# Altium schematic sheet H-00488 - Power.SchDoc: Power Supplies
size 403 x 281 mm; DocumentNumber: 3; SheetNumber: 3; SheetTotal: 12
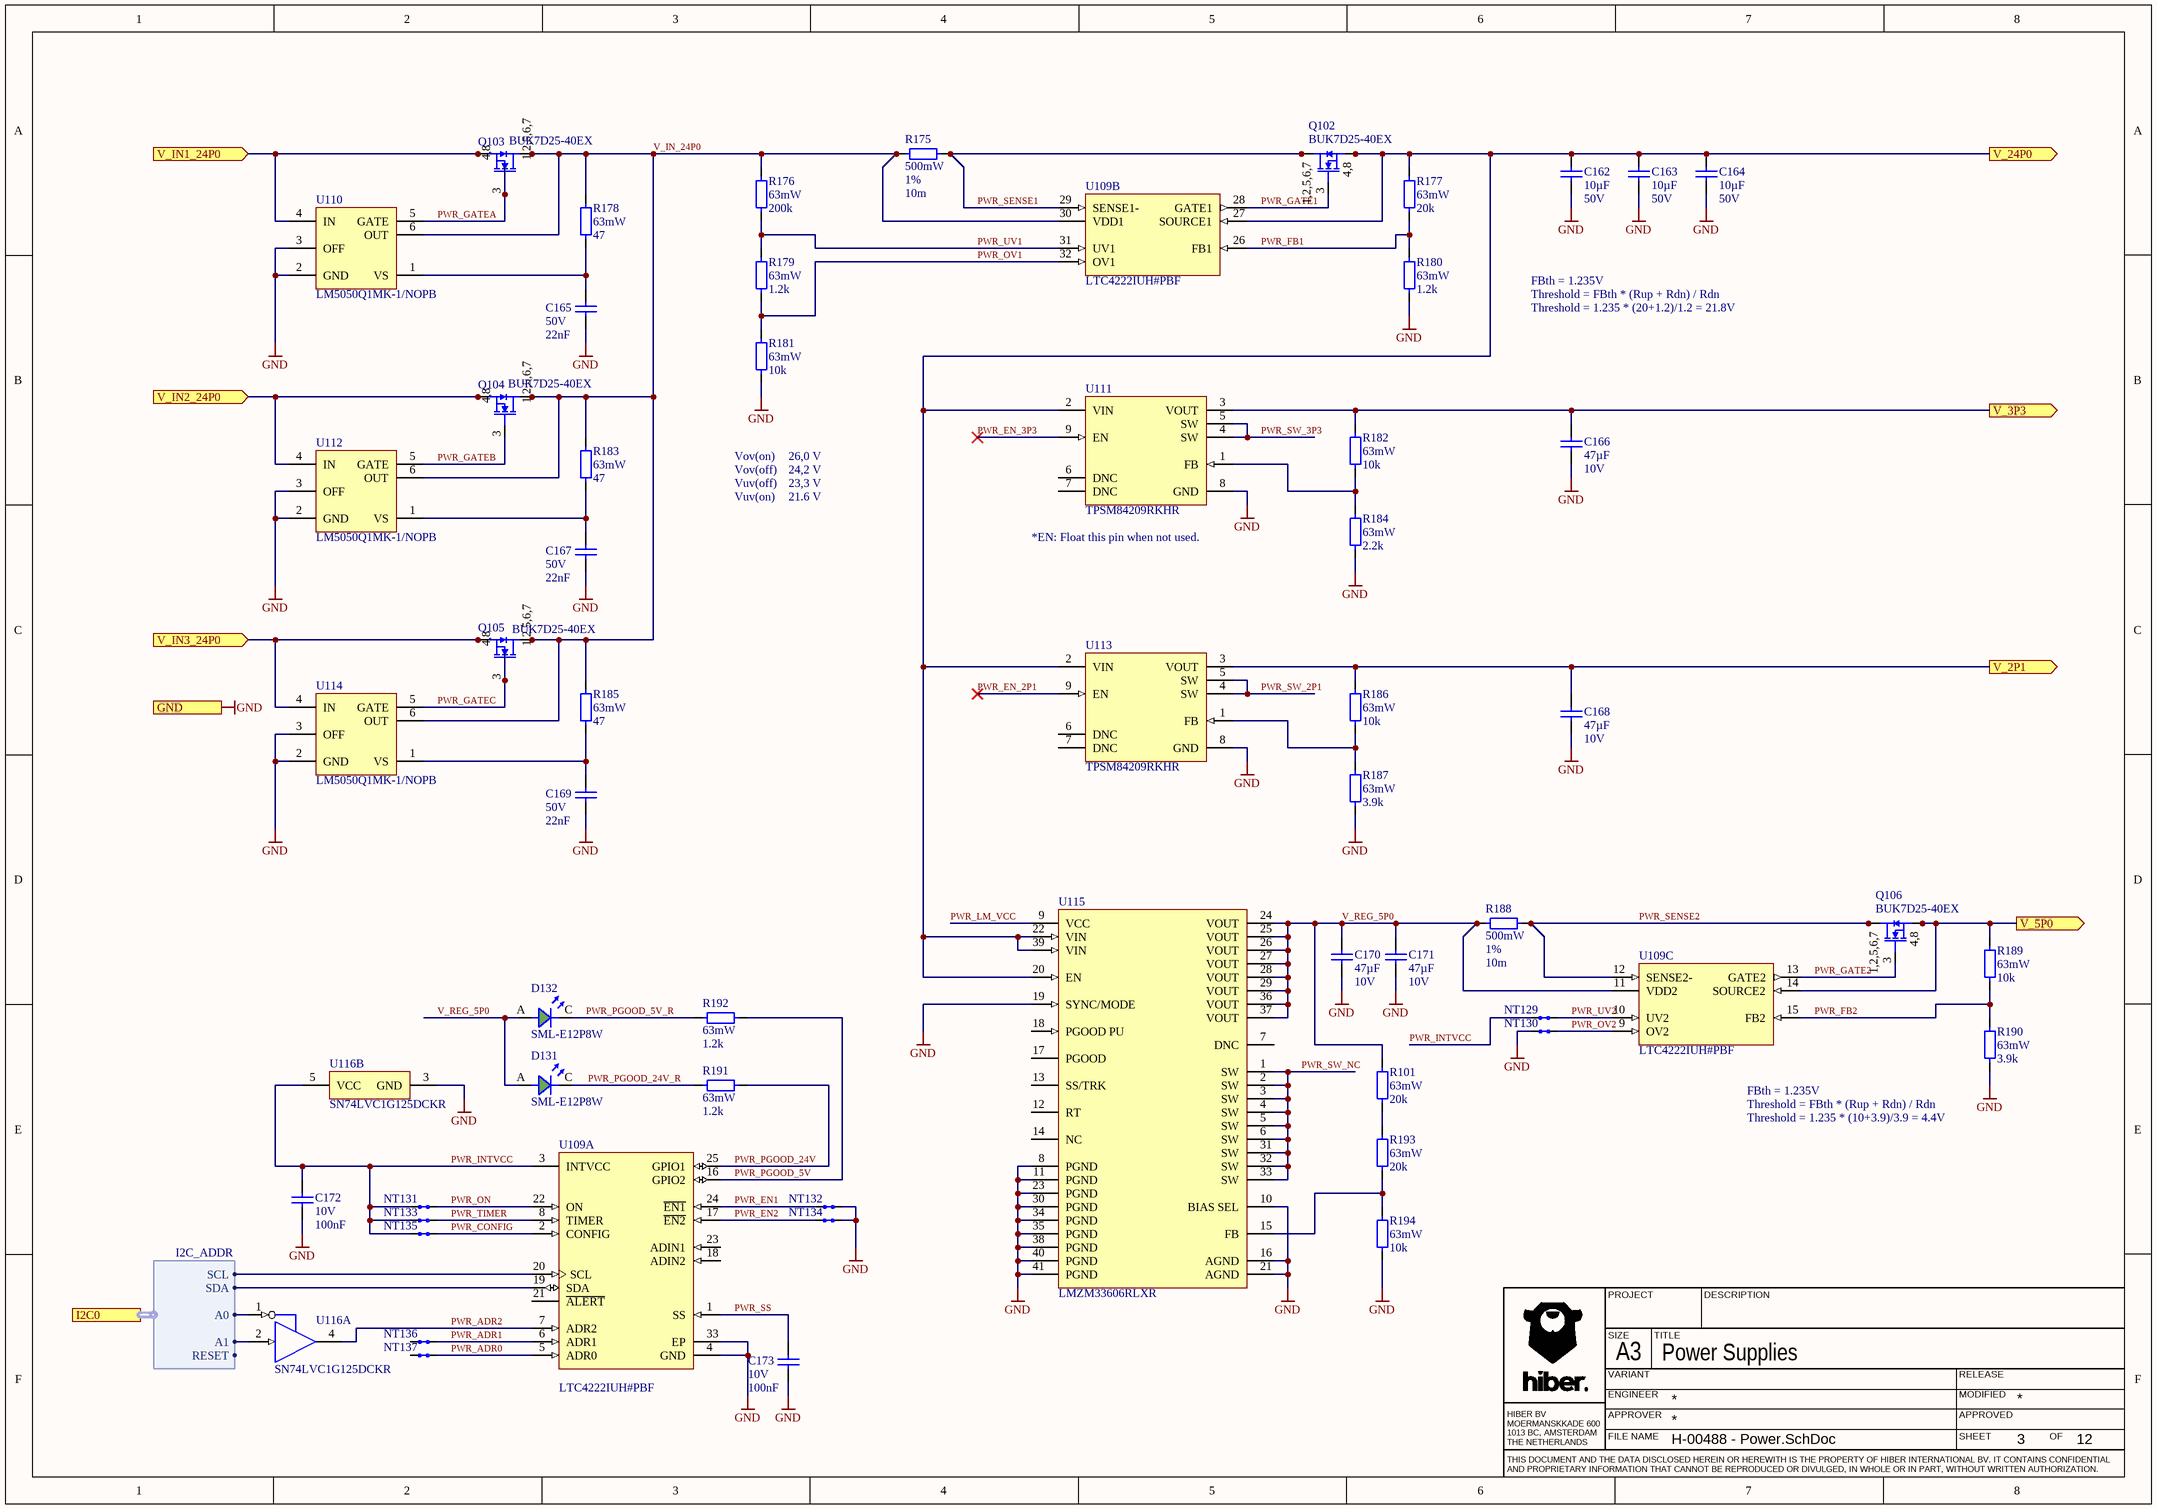
[diagram p0: H-00488 - Power.SchDoc]

## Parts
C162  value 10µF  Rated Voltage: 50V  [CAPC320X250X245L50N]  (hidden comment: C1210C106K5RACTU)
C163  value 10µF  Rated Voltage: 50V  [CAPC320X250X245L50N]  (hidden comment: C1210C106K5RACTU)
C164  value 10µF  Rated Voltage: 50V  [CAPC320X250X245L50N]  (hidden comment: C1210C106K5RACTU)
C165  value 22nF  Rated Voltage: 50V  [CAPC100X50X55L30N]  (hidden comment: C0402C223K5RACTU)
C166  value 47µF  Rated Voltage: 10V  [CAPC320X250X170L50N]  (hidden comment: C1210C476M8RACTU)
C167  value 22nF  Rated Voltage: 50V  [CAPC100X50X55L30N]  (hidden comment: C0402C223K5RACTU)
C168  value 47µF  Rated Voltage: 10V  [CAPC320X250X170L50N]  (hidden comment: C1210C476M8RACTU)
C169  value 22nF  Rated Voltage: 50V  [CAPC100X50X55L30N]  (hidden comment: C0402C223K5RACTU)
C170  value 47µF  Rated Voltage: 10V  [CAPC320X250X170L50N]  (hidden comment: C1210C476M8RACTU)
C171  value 47µF  Rated Voltage: 10V  [CAPC320X250X170L50N]  (hidden comment: C1210C476M8RACTU)
C172  value 100nF  Rated Voltage: 10V  [CAPC100X50X55L30N]  (hidden comment: C0402C104K8RACTU)
C173  value 100nF  Rated Voltage: 10V  [CAPC100X50X55L30N]  (hidden comment: C0402C104K8RACTU)
D131  SML-E12P8W  [LEDC170X80X80L20_GREEN]
D132  SML-E12P8W  [LEDC170X80X80L20_GREEN]
NT129  NET-TIE  [NT200]  (value not drawn)  (net tie, no BOM)
NT130  NET-TIE  [NT200]  (value not drawn)  (net tie, no BOM)
NT131  NET-TIE  [NT200]  (value not drawn)  (net tie, no BOM)
NT132  NET-TIE  [NT200]  (value not drawn)  (net tie, no BOM)
NT133  NET-TIE  [NT200]  (value not drawn)  (net tie, no BOM)
NT134  NET-TIE  [NT200]  (value not drawn)  (net tie, no BOM)
NT135  NET-TIE  [NT200]  (value not drawn)  (net tie, no BOM)
NT136  NET-TIE  [NT200]  (value not drawn)  (net tie, no BOM)
NT137  NET-TIE  [NT200]  (value not drawn)  (net tie, no BOM)
Q102  BUK7D25-40EX  [NEXPERIA_SOT1220]
Q103  BUK7D25-40EX  [NEXPERIA_SOT1220]
Q104  BUK7D25-40EX  [NEXPERIA_SOT1220]
Q105  BUK7D25-40EX  [NEXPERIA_SOT1220]
Q106  BUK7D25-40EX  [NEXPERIA_SOT1220]
R101  value 20k  Rated Power: 63mW  [RESC100X50X40L25N]  (hidden comment: CRCW040220K0FKED)
R175  value 10m  Rated Power: 500mW  Tolerance: 1%  [RESC200X125X70L40M]  (hidden comment: WSLP0805R0100FEA)
R176  value 200k  Rated Power: 63mW  [RESC100X50X40L25N]  (hidden comment: CRCW0402200KFKED)
R177  value 20k  Rated Power: 63mW  [RESC100X50X40L25N]  (hidden comment: CRCW040220K0FKED)
R178  value 47  Rated Power: 63mW  [RESC100X50X40L25N]  (hidden comment: CRCW040247R0FKED)
R179  value 1.2k  Rated Power: 63mW  [RESC100X50X40L25N]  (hidden comment: CRCW04021K20FKED)
R180  value 1.2k  Rated Power: 63mW  [RESC100X50X40L25N]  (hidden comment: CRCW04021K20FKED)
R181  value 10k  Rated Power: 63mW  [RESC100X50X40L25N]  (hidden comment: CRCW040210K0FKED)
R182  value 10k  Rated Power: 63mW  [RESC100X50X40L25N]  (hidden comment: CRCW040210K0FKED)
R183  value 47  Rated Power: 63mW  [RESC100X50X40L25N]  (hidden comment: CRCW040247R0FKED)
R184  value 2.2k  Rated Power: 63mW  [RESC100X50X40L25N]  (hidden comment: CRCW04022K20FKED)
R185  value 47  Rated Power: 63mW  [RESC100X50X40L25N]  (hidden comment: CRCW040247R0FKED)
R186  value 10k  Rated Power: 63mW  [RESC100X50X40L25N]  (hidden comment: CRCW040210K0FKED)
R187  value 3.9k  Rated Power: 63mW  [RESC100X50X40L25N]  (hidden comment: CRCW04023K90FKED)
R188  value 10m  Rated Power: 500mW  Tolerance: 1%  [RESC200X125X70L40M]  (hidden comment: WSLP0805R0100FEA)
R189  value 10k  Rated Power: 63mW  [RESC100X50X40L25N]  (hidden comment: CRCW040210K0FKED)
R190  value 3.9k  Rated Power: 63mW  [RESC100X50X40L25N]  (hidden comment: CRCW04023K90FKED)
R191  value 1.2k  Rated Power: 63mW  [RESC100X50X40L25N]  (hidden comment: CRCW04021K20FKED)
R192  value 1.2k  Rated Power: 63mW  [RESC100X50X40L25N]  (hidden comment: CRCW04021K20FKED)
R193  value 20k  Rated Power: 63mW  [RESC100X50X40L25N]  (hidden comment: CRCW040220K0FKED)
R194  value 10k  Rated Power: 63mW  [RESC100X50X40L25N]  (hidden comment: CRCW040210K0FKED)
U109  LTC4222IUH#PBF  [QFN33P50_500X500X80L40X25T345]  (parts A,B,C of 3)
U110  LM5050Q1MK-1/NOPB  [SOT23-6P95_280X110L45X40M]
U111  TPSM84209RKHR  [TI_RKH0009A]
U112  LM5050Q1MK-1/NOPB  [SOT23-6P95_280X110L45X40M]
U113  TPSM84209RKHR  [TI_RKH0009A]
U114  LM5050Q1MK-1/NOPB  [SOT23-6P95_280X110L45X40M]
U115  LMZM33606RLXR  [TI_RLX0041A]
U116  SN74LVC1G125DCKR  [SOT23-5P65_210X110L36X22]  (parts A,B of 2)

## Ports
GND, I2C0 (harness I2C_ADDR), V_2P1 (out), V_3P3 (out), V_5P0 (out), V_24P0 (out), V_IN1_24P0 (in), V_IN2_24P0 (in), V_IN3_24P0 (in)

## Harnesses
I2C_ADDR: SDA, SCL, A0, A1, RESET

## Nets
GND: C162.1 C163.1 C164.1 C165.2 C166.2 C167.2 C168.2 C169.2 C170.2 C171.2 C172.2 C173.2 NT130.1 NT132.2 NT134.2 R180.2 R181.2 R184.2 R187.2 R190.2 R194.2 U109.4(GND) U109.33(EP) U110.2(GND) U110.3(OFF) U111.8(GND) U112.2(GND) U112.3(OFF) U113.8(GND) U114.2(GND) U114.3(OFF) U115.8(PGND) U115.10(BIAS_SEL) U115.11(PGND) U115.16(AGND) U115.19(SYNC/MODE) U115.21(AGND) U115.23(PGND) U115.30(PGND) U115.34(PGND) U115.35(PGND) U115.38(PGND) U115.40(PGND) U115.41(PGND) U116.3(GND) ; port GND
PWR_ADR0: NT137.2 U109.5(ADR0)
PWR_ADR1: NT136.2 U109.6(ADR1)
PWR_ADR2: U109.7(ADR2) U116.4(Y)
PWR_CONFIG: NT135.2 U109.2(CONFIG)
PWR_EN1: NT132.1 U109.24(~{EN1})
PWR_EN2: NT134.1 U109.17(~{EN2})
PWR_EN_2P1: U113.9(EN)
PWR_EN_3P3: U111.9(EN)
PWR_FB1: R177.2 R180.1 U109.26(FB1)
PWR_FB2: R189.2 R190.1 U109.15(FB2)
PWR_GATE1: Q102.3(G) U109.28(GATE1)
PWR_GATE2: Q106.3(G) U109.13(GATE2)
PWR_GATEA: Q103.3(G) U110.5(GATE)
PWR_GATEB: Q104.3(G) U112.5(GATE)
PWR_GATEC: Q105.3(G) U114.5(GATE)
PWR_INTVCC: C172.1 NT129.1 NT131.1 NT133.1 NT135.1 U109.3(INTVCC) U116.5(VCC)
PWR_LM_VCC: U115.9(VCC)
PWR_ON: NT131.2 U109.22(ON)
PWR_OV1: R179.2 R181.1 U109.32(OV1)
PWR_OV2: NT130.2 U109.9(OV2)
PWR_PGOOD_5V: R192.2 U109.16(GPIO2)
PWR_PGOOD_5V_R: D132.C R192.1
PWR_PGOOD_24V: R191.2 U109.25(GPIO1)
PWR_PGOOD_24V_R: D131.C R191.1
PWR_SENSE1: Q102.1(D) Q102.2(D) Q102.5(D) Q102.6(D) Q102.7(D) R175.1 U109.29(SENSE1-)
PWR_SENSE2: Q106.1(D) Q106.2(D) Q106.5(D) Q106.6(D) Q106.7(D) R188.1 U109.12(SENSE2-)
PWR_SS: C173.1 U109.1(SS)
PWR_SW_2P1: U113.4(SW) U113.5(SW)
PWR_SW_3P3: U111.4(SW) U111.5(SW)
PWR_SW_NC: U115.1(SW) U115.2(SW) U115.3(SW) U115.4(SW) U115.5(SW) U115.6(SW) U115.31(SW) U115.32(SW) U115.33(SW)
PWR_TIMER: NT133.2 U109.8(TIMER)
PWR_UV1: R176.2 R179.1 U109.31(UV1)
PWR_UV2: NT129.2 U109.10(UV2)
V_2P1: C168.1 R186.1 U113.3(VOUT) ; port V_2P1
V_3P3: C166.1 R182.1 U111.3(VOUT) ; port V_3P3
V_5P0: Q106.4(S) Q106.8(S) R189.1 U109.14(SOURCE2) ; port V_5P0
V_24P0: C162.2 C163.2 C164.2 Q102.4(S) Q102.8(S) R177.1 U109.27(SOURCE1) U111.2(VIN) U113.2(VIN) U115.20(EN) U115.22(VIN) U115.39(VIN) ; port V_24P0
V_IN1_24P0: Q103.4(S) Q103.8(S) U110.4(IN) ; port V_IN1_24P0
V_IN2_24P0: Q104.4(S) Q104.8(S) U112.4(IN) ; port V_IN2_24P0
V_IN3_24P0: Q105.4(S) Q105.8(S) U114.4(IN) ; port V_IN3_24P0
V_IN_24P0: Q103.1(D) Q103.2(D) Q103.5(D) Q103.6(D) Q103.7(D) Q104.1(D) Q104.2(D) Q104.5(D) Q104.6(D) Q104.7(D) Q105.1(D) Q105.2(D) Q105.5(D) Q105.6(D) Q105.7(D) R175.2 R176.1 R178.1 R183.1 R185.1 U109.30(VDD1) U110.6(OUT) U112.6(OUT) U114.6(OUT)
V_REG_5P0: C170.1 C171.1 D131.A D132.A R101.1 R188.2 U109.11(VDD2) U115.24(VOUT) U115.25(VOUT) U115.26(VOUT) U115.27(VOUT) U115.28(VOUT) U115.29(VOUT) U115.36(VOUT) U115.37(VOUT)
NetC165_1: C165.1 R178.2 U110.1(VS)
NetC167_1: C167.1 R183.2 U112.1(VS)
NetC169_1: C169.1 R185.2 U114.1(VS)
NetR101_2: R101.2 R193.1
NetR182_2: R182.2 R184.1 U111.1(FB)
NetR186_2: R186.2 R187.1 U113.1(FB)
NetR193_2: R193.2 R194.1 U115.15(FB)
NetU109_19: U109.19(SDA) ; port I2C0.SDA
NetU109_20: U109.20(SCL) ; port I2C0.SCL
NetU116_1: U116.1(~{OE}) ; port I2C0.A0
NetU116_2: U116.2(A) ; port I2C0.A1

Not connected (* = marked no-connect by the designer): NT136 1; NT137 1; U109 18(ADIN2) 21(~{ALERT}) 23(ADIN1); U111 6(DNC) 7(DNC); U113 6(DNC) 7(DNC); U115 7(DNC) 12(RT) 13(SS/TRK) 14(NC) 17(PGOOD) 18(PGOOD_PU)

## Notes on the sheet
- FBth = 1.235V
- Threshold = FBth * (Rup + Rdn) / Rdn
- Threshold = 1.235 * (20+1.2)/1.2 = 21.8V
- Vov(on)
- Vov(off)
- Vuv(off)
- Vuv(on)
- 26,0 V
- 24,2 V
- 23,3 V
- 21.6 V
- (near U111) *EN: Float this pin when not used.
- Threshold = 1.235 * (10+3.9)/3.9 = 4.4V
- PROJECT
- DESCRIPTION
- SIZE
- ENGINEER
- VARIANT
- A3
- TITLE
- MODIFIED
- RELEASE
- HIBER BV
  MOERMANSKKADE 600
  1013 BC, AMSTERDAM
  THE NETHERLANDS
- FILE NAME
- APPROVER
- SHEET
- APPROVED
- OF
- THIS DOCUMENT AND THE DATA DISCLOSED HEREIN OR HEREWITH IS THE PROPERTY OF HIBER INTERNATIONAL BV. IT CONTAINS CONFIDENTIAL AND PROPRIETARY INFORMATION THAT CANNOT BE REPRODUCED OR DIVULGED, IN WHOLE OR IN PART, WITHOUT WRITTEN AUTHORIZATION.
- (in symbol CMP-01110-3) 1,2,5,6,7; 4,8

## Library data of the parts
C162-C164 = CMP-00463-1: CAP Standard 1210 (3225) 10,0uF 50V X7R (Standard); Type: Ceramic; Tolerance: 10%; Failure Rate: N/A; Pins: 2; Termination Finish: 100% Matte Sn; Case/Package: 1210 (3225); Dielectric: X7R; RoHS: Yes; Mount: Surface Mount; Qualification: Standard
C165 C167 C169 = CMP-00404-3: CAP Standard 0402 (1005) 22,0nF 50V X7R (Standard); Type: Ceramic; Tolerance: 10%; Termination Finish: 100% Matte Sn; Qualification: Standard; RoHS: Yes; Mount: SMD; Case/Package: 0402 (1005); Failure Rate: N/A; Pins: 2; Dielectric: X7R
C166 C168 C170 C171 = CMP-00658-1: CAP Standard 1210 (3225) 47,0uF 10V X7R (Standard); Type: Ceramic; Tolerance: 20%; RoHS: Yes; Termination Finish: 100% Matte Sn; Failure Rate: N/A; Qualification: Standard; Mount: Surface Mount; Dielectric: X7R; Pins: 2; Case/Package: 1210 (3225)
C172 C173 = CMP-00367-3: CAP Standard 0402 (1005) 100,0nF 10V X7R (Standard); Type: Ceramic; Tolerance: 10%; Termination Finish: 100% Matte Sn; Qualification: Standard; RoHS: Yes; Mount: SMT; Case/Package: 0402 (1005); Failure Rate: N/A; Pins: 2; Dielectric: X7R
D131 D132 = CMP-00431-1: LED Green Diffused 0603 SMD; Dominant Wavelength: 630nm; Viewing Angle: 140°; Test Current: 20mA; Forward Voltage: 2,5V; Typical Wavelength: 560nm; Number of LEDs: 1; Lens Style: Clear, Colorless, Diffused, Rectangular; Luminous Intensity: 6.3mcd; Chip Structure: AlGaInP; Illumination Colour: Red; Lens Colour: White; Package Quantity: 1; Max Operating Temperature: 85°C; Width: 0.8mm; Case Code (Imperial): 0603; Length: 1.6mm; Lens Transparency: Diffused; Lead Free: Lead Free; Number of Pins: 2; Mount: Surface Mount; Height: 0.46mm; Color: Green; Case/Package: 0603; Forward Current: 20mA; Radiation Hardening: No; Min Operating Temperature: -40°C; Wavelength: 630nm; Case Code (Metric): 1608; Packaging: Tape and Reel
NT129-NT137 = CMP-00523-9: Net Tie, Inline
Q102-Q106 = CMP-01110-3: BUK7D25 Series 40V Surface-Mounted N-channel Trench MOSFET - SOT1118; Qualification: Standard; Mount: Surface-Mount; Case/Package: SOT1220; RoHS: Yes
R101 R177 R193 = CMP-00301-7: RES Standard Thick Film 0402 20K0 ±1% 0,063W; Qualification: Automotive; Rated Voltage: 50V; Mount: Surface Mount; Termination Finish: Pure tin solder contacts on Ni barrier layer; Case/Package: 0402 (1005); Pins: 2; Tolerance: 1%; Failure Rate: N/A; Type: Standard Thick Film; RoHS: Yes
R175 R188 = CMP-00544-3: RES Power Metal Strip 0805 0R01 ±1% 0,5W; Qualification: Automotive; Case/Package: 0805(2012); RoHS: Yes; Pins: 2; Type: Power Metal Strip; Mount: SMD
R176 = CMP-00325-7: RES Standard Thick Film 0402 200K ±1% 0,063W; Qualification: Automotive; Rated Voltage: 50V; Mount: Surface Mount; Termination Finish: Pure tin solder contacts on Ni barrier layer; Case/Package: 0402 (1005); Pins: 2; Tolerance: 1%; Failure Rate: N/A; Type: Standard Thick Film; RoHS: Yes
R178 R183 R185 = CMP-00238-8: RES Standard Thick Film 0402 47R0 ±1% 0,063W; Qualification: Automotive; Rated Voltage: 50V; Mount: Surface Mount; Termination Finish: Pure tin solder contacts on Ni barrier layer; Case/Package: 0402 (1005); Pins: 2; Tolerance: 1%; Failure Rate: N/A; Type: Standard Thick Film; RoHS: Yes
R179 R180 R191 R192 = CMP-00272-8: RES Standard Thick Film 0402 1K20 ±1% 0,063W; Qualification: Automotive; Rated Voltage: 50V; Mount: Surface Mount; Termination Finish: Pure tin solder contacts on Ni barrier layer; Case/Package: 0402 (1005); Pins: 2; Tolerance: 1%; Failure Rate: N/A; Type: Standard Thick Film; RoHS: Yes
R181 R182 R186 R189 R194 = CMP-00294-7: RES Standard Thick Film 0402 10K0 ±1% 0,063W; Qualification: Automotive; Rated Voltage: 50V; Mount: Surface Mount; Termination Finish: Pure tin solder contacts on Ni barrier layer; Case/Package: 0402 (1005); Pins: 2; Tolerance: 1%; Failure Rate: N/A; Type: Standard Thick Film; RoHS: Yes
R184 = CMP-00278-8: RES Standard Thick Film 0402 2K20 ±1% 0,063W; Qualification: Automotive; Rated Voltage: 50V; Mount: Surface Mount; Termination Finish: Pure tin solder contacts on Ni barrier layer; Case/Package: 0402 (1005); Pins: 2; Tolerance: 1%; Failure Rate: N/A; Type: Standard Thick Film; RoHS: Yes
R187 R190 = CMP-00284-8: RES Standard Thick Film 0402 3K90 ±1% 0,063W; Qualification: Automotive; Rated Voltage: 50V; Mount: Surface Mount; Termination Finish: Pure tin solder contacts on Ni barrier layer; Case/Package: 0402 (1005); Pins: 2; Tolerance: 1%; Failure Rate: N/A; Type: Standard Thick Film; RoHS: Yes
U109 = CMP-01087-7: Power Supply Support Circuit, Adjustable, 2 Channel, CMOS, PQCC32; Adjustable Threshold: Yes; Supply Voltage-Min (Vsup): 2.9V; Supply Voltage-Nom (Vsup): 12V; Number of Channels: 2; Time @ Peak Reflow Temperature-Max (s): 30s; Number of Functions: 1; Supply Voltage-Max (Vsup): 29V; Package Body Material: Plastic; Qualification Status: Not Qualified; Package Style: CHIP CARRIER, HEAT SINK/SLUG, VERY THIN PROFILEMeter; Terminal Pitch: 0.5mm; Moisture Sensitivity Level: 1; Width: 5mm; Surface Mount: Yes; Terminal Position: QUAD; Terminal Finish: Tin; Terminal Form: No Lead; Analog IC - Other Type: POWER SUPPLY SUPPORT CIRCUIT; Max Operating Temperature: 85°C; Package Shape: Square; Height - Seated (Max): 0.8mm; JESD-30 Code: S-PQCC-N32; JESD-609 Code: e3; Temperature Grade: INDUSTRIAL; Peak Reflow Temperature (Cel): 260°C; Min Operating Temperature: -40°C; Number of Pins: 32; Package Code: HVQCCN; Length: 5mm
U110 U112 U114 = CMP-01122-2: Half Bridge Based MOSFET Driver, PDSO6; Package Body Material: Plastic; Power Supplies: 12V; Max Supply Voltage: 75V; Number of Functions: 1; High Side Driver: Yes; Qualification Status: Not Qualified; Min Supply Voltage: 5V; Package Equivalence Code: TSOP6,.11,37; Surface Mount: Yes; JESD-30 Code: R-PDSO-G6; Terminal Position: DUAL; Terminal Pitch: 0.95mm; Max Operating Temperature: 125°C; Height - Seated (Max): 1.1mm; Length: 2.9mm; Terminal Finish: Tin; Moisture Sensitivity Level: 1; Supply Voltage-Nom: 12V; Package Code: TSSOP; Width: 1.6mm; Min Operating Temperature: -40°C; Interface IC Type: HALF BRIDGE BASED MOSFET DRIVER; Temperature Grade: AUTOMOTIVE; Number of Pins: 6; Package Style: SMALL OUTLINE, THIN PROFILE, SHRINK PITCHMeter; Peak Reflow Temperature (Cel): 260°C; Package Shape: Rectangular; Terminal Form: Gull Wing; JESD-609 Code: e3
U111 U113 = CMP-01146-2: Switching Regulator, 2.5A, 923kHz Switching Freq-Max, PQCC9
U115 = CMP-01147-5: Switching Regulator, 6A, 2200kHz Switching Freq-Max, PQMA41
U116 = CMP-01092-2: Bus Driver, LVC/LCX/Z Series, 1-Func, 1-Bit, True Output, CMOS, PDSO5; Output Characteristics: 3-STATE; Supply Voltage-Min (Vsup): 1.65V; Number of Functions: 1; Max I(ol): 24mA; Supply Voltage-Max (Vsup): 5.5V; Number of Ports: 2; Qualification Status: Not Qualified; Load/Preset Input: Yes; Propagation Delay (tpd): 9ns; Package Body Material: Plastic; Load Capacitance (CL): 50pF; Package Equivalence Code: TSSOP5/6,.08; Prop. Delay@Nom-Sup: 4.5ns; Power Supplies: 3.3V; Control Type: ENABLE LOW; Height - Seated (Max): 1.1mm; Peak Reflow Temperature (Cel): 260°C; Surface Mount: Yes; Packaging: Tape and Reel; Logic IC Type: BUS DRIVER; Technology: CMOS; JESD-609 Code: e4; Max Operating Temperature: 125°C; Length: 2mm; Temperature Grade: AUTOMOTIVE; Min Operating Temperature: -40°C; Number of Bits: 1; Terminal Finish: Nickel; Package Code: TSSOP; JESD-30 Code: R-PDSO-G5; Package Shape: Rectangular; Number of Pins: 5; Package Style: SMALL OUTLINE, THIN PROFILE, SHRINK PITCHMeter; Output Polarity: True; Moisture Sensitivity Level: 1; Width: 1.25mm; Terminal Form: Gull Wing; Terminal Position: DUAL; Terminal Pitch: 0.65mm; Supply Voltage-Nom (Vsup): 3.3V